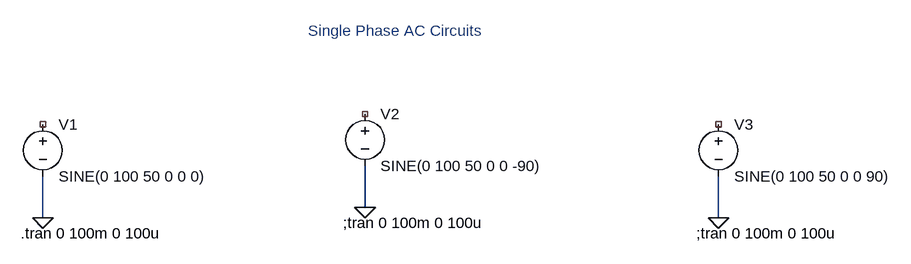
[diagram p0: schematic ac 1.asc]
ac 1.asc, the LTspice schematic file:
Version 4
SHEET 1 992 680
WIRE 160 336 160 272
WIRE -336 352 -336 288
WIRE 704 352 704 288
FLAG -336 352 0
FLAG 160 336 0
FLAG 704 352 0
SYMBOL voltage -336 192 R0
WINDOW 123 0 0 Left 0
WINDOW 39 0 0 Left 0
SYMATTR InstName V1
SYMATTR Value SINE(0 100 50 0 0 0)
SYMBOL voltage 160 176 R0
WINDOW 123 0 0 Left 0
WINDOW 39 0 0 Left 0
SYMATTR InstName V2
SYMATTR Value SINE(0 100 50 0 0 -90)
SYMBOL voltage 704 192 R0
WINDOW 123 0 0 Left 0
WINDOW 39 0 0 Left 0
SYMATTR InstName V3
SYMATTR Value SINE(0 100 50 0 0 90)
TEXT 72 64 Left 2 ;Single Phase AC Circuits
TEXT -370 376 Left 2 !.tran 0 100m 0 100u
TEXT 126 360 Left 2 !;tran 0 100m 0 100u
TEXT 670 376 Left 2 !;tran 0 100m 0 100u

The netlist it stands for:
* ac 1.asc
V1 NC_01 0 SINE(0 100 50 0 0 0)
V2 NC_02 0 SINE(0 100 50 0 0 -90)
V3 NC_03 0 SINE(0 100 50 0 0 90)
* Single Phase AC Circuits
.tran 0 100m 0 100u
;tran 0 100m 0 100u
;tran 0 100m 0 100u
.backanno
.end